# Altium schematic sheet DisplayReceiver_Microcontroller.SchDoc
size 420 x 297 mm; DocumentNumber: ФНКЦ.542321.001 Э3; SheetNumber: 3; Format: A3
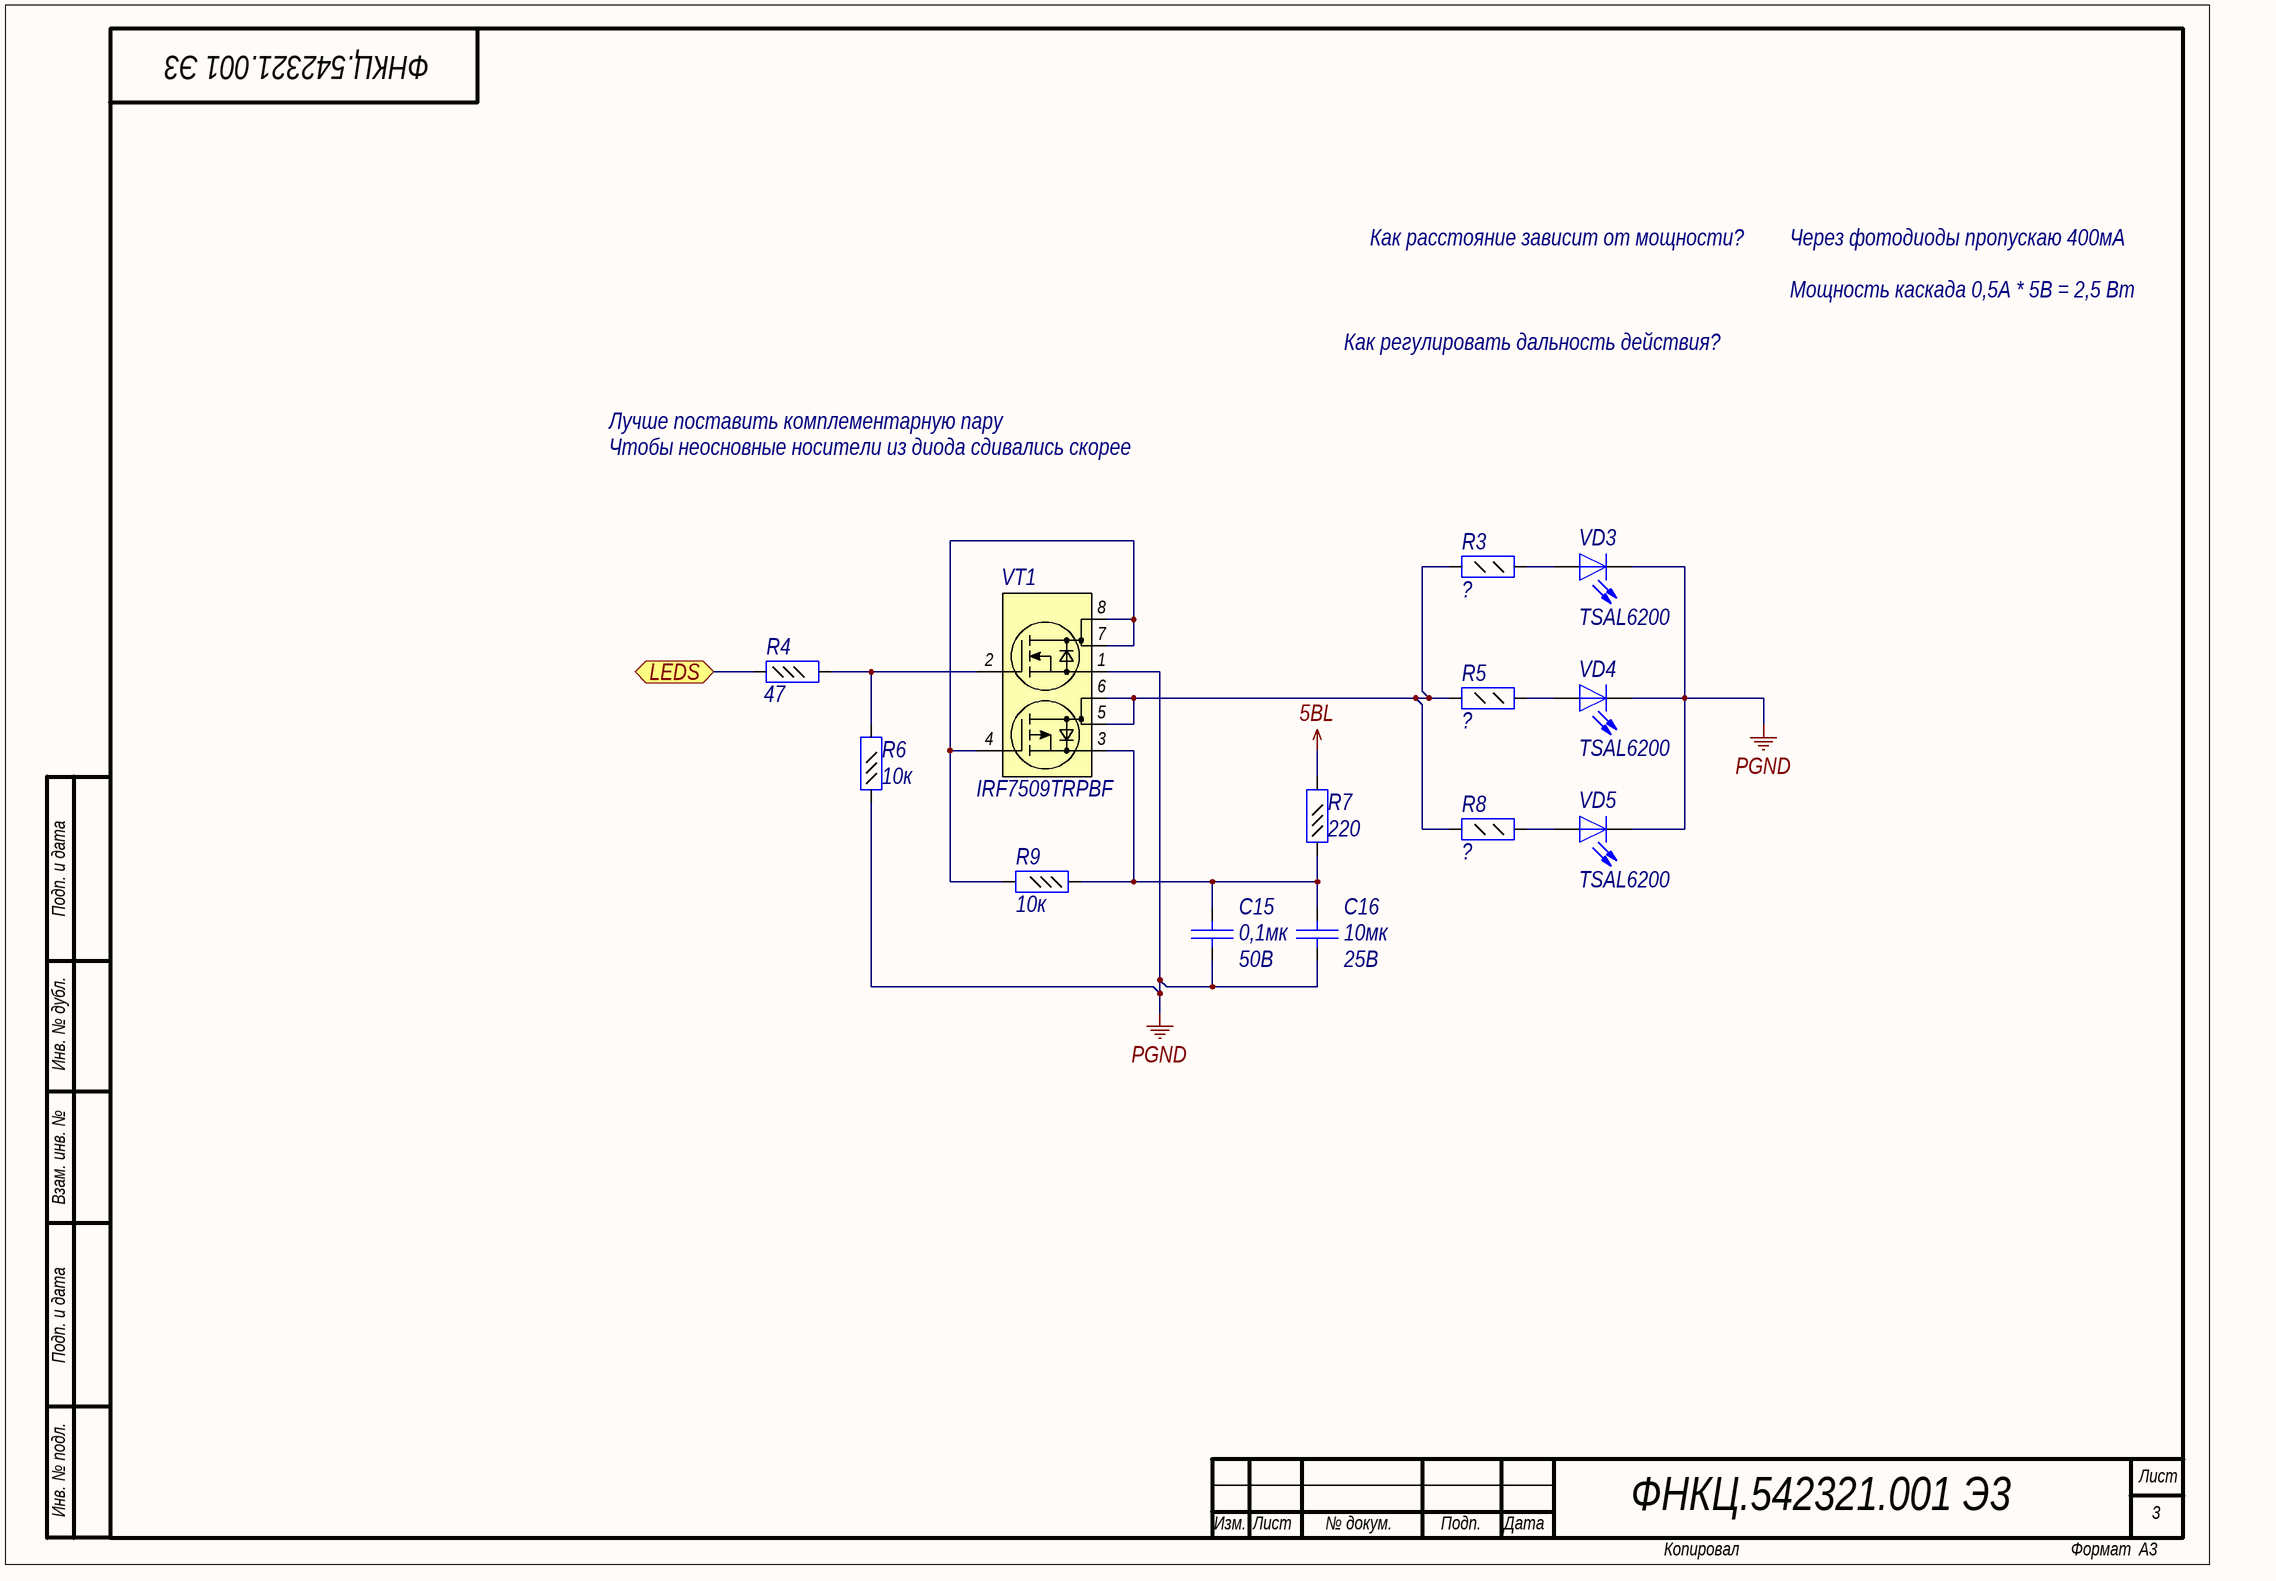
[diagram p0: DisplayReceiver_Microcontroller.SchDoc]

## Parts
C15  value 0,1мк  Voltage: 50B  [C0603]  (hidden comment: Capacitor)
C16  value 10мк  Voltage: 25В  [C1210]  (hidden comment: Capacitor)
R3  Resistor_0,125Вт  [R0805]  (value not drawn)
R4  value 47  [R0603]  (hidden comment: Resistor_0,062Вт)
R5  Resistor_0,125Вт  [R0805]  (value not drawn)
R6  value 10к  [R0603]  (hidden comment: Resistor_0,062Вт)
R7  value 220  [R0603]  (hidden comment: Resistor_0,062Вт)
R8  Resistor_0,125Вт  [R0805]  (value not drawn)
R9  value 10к  [R0603]  (hidden comment: Resistor_0,062Вт)
VD3  Part Number: TSAL6200  [RADIAL_5MM]  (hidden comment: LED)
VD4  Part Number: TSAL6200  [RADIAL_5MM]  (hidden comment: LED)
VD5  Part Number: TSAL6200  [RADIAL_5MM]  (hidden comment: LED)
VT1  IRF7509TRPBF  [Micro8]

## Ports
LEDS

## Nets
5ВL: R7.2
PGND: C15.1 C16.1 R6.1 VD3.1(K) VD4.1(K) VD5.1(K) VT1.1(S1)
LEDS: R4.1 ; port LEDS
NetC15_2: C15.2 C16.2 R7.1 R9.1 VT1.3(S2)
NetR3_1: R3.1 VD3.2(A)
NetR3_2: R3.2 R5.2 R8.2 VT1.5(D2) VT1.6(D2)
NetR4_2: R4.2 R6.2 VT1.2(G1)
NetR5_1: R5.1 VD4.2(A)
NetR8_1: R8.1 VD5.2(A)
NetR9_2: R9.2 VT1.4(G2) VT1.7(D1) VT1.8(D1)

## Notes on the sheet
- Как расстояние зависит от мощности?
- Через фотодиоды пропускаю 400мА
- Мощность каскада 0,5А * 5В = 2,5 Вт
- Как регулировать дальность действия?
- Лучше поставить комплементарную пару
- Чтобы неосновные носители из диода сдивались скорее
- Подп. и дата
- Инв. № дубл.
- Взам. инв. №
- Инв. № подл.
- Лист
- Изм.
- № докум.
- Подп.
- Дата
- Копировал
- Формат

## Library data of the parts
C15 = cap131: Конденсатор; Part Name: Ceramic; Manufacture: Murata; Part Number: GRM188R71H104K; id: cap131; TKE: X7R
C16 = cap194: Конденсатор; Part Name: Ceramic; Manufacture: Murata; Part Number: GRM32ER61A106K; id: cap194; TKE: X7R
R3 R5 R8 = res33: Резистор; Manufacture: Yageo; Part Number: RC0805FR-0722RL; id: res33; Accuracy: 1%; Value: ?; Part Name: Resistor; Power: 0,125Вт
R4 = res427: Резистор; Manufacture: Yageo; Part Number: RC0603FR-0747RL; id: res427; Accuracy: 1%; Part Name: Resistor; Power: 0,062Вт
R6 R9 = res483: Резистор; Manufacture: Yageo; Part Number: RC0603FR-0710KL; id: res483; Accuracy: 1%; Part Name: Resistor; Power: 0,062Вт
R7 = res443: Резистор; Manufacture: Yageo; Part Number: RC0603FR-07220RL; id: res443; Accuracy: 1%; Part Name: Resistor; Power: 0,062Вт
VD3-VD5 = diode24: Светодиод; Part Name: High Power Infrared Emitting Diode; Manufacture: Vishay; Max Reverse Voltage: 5B; Forward Voltage: 1,35-2,2B; Forward Current: 100mA; Surge Forward Current: 1,5A(impulse - 100us); Radiant intensity: 72-600mW/sr; Radiant power: 40mW; Max Power dissipation: 160mW; Angle of half intensity: (+-)17; Peak wavelength: 940nm; Number of Channels: 1; id: diode24
VT1 = trans3: Комплементарная сборка МОП; Part Name: Dual Transistor; Manufacturer: International Rectifier; id: trans3; Structure: n-p-channel; V drain-source max: 30B; Rds: 0,11Ohm; Gate-to-source voltage: (+-)20B; Continuous drain current: 2A; Pulsed drain current: 16A; Power dissipation: 1,25W; Part Number: IRF7509TRPBF